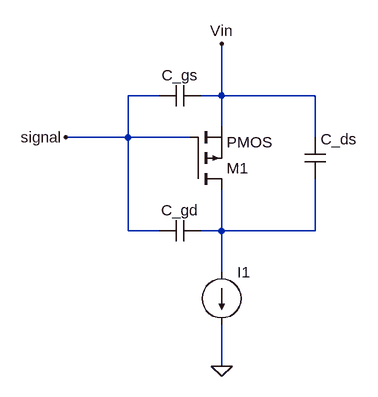
[diagram p0: schematic Draft1.asc]
Draft1.asc, the LTspice schematic file:
Version 4
SHEET 1 880 680
WIRE 176 96 128 96
WIRE 272 96 272 16
WIRE 272 96 240 96
WIRE 416 96 272 96
WIRE 272 144 272 96
WIRE 128 160 128 96
WIRE 128 160 32 160
WIRE 224 160 128 160
WIRE 416 160 416 96
WIRE 128 304 128 160
WIRE 176 304 128 304
WIRE 272 304 272 240
WIRE 272 304 240 304
WIRE 416 304 416 224
WIRE 416 304 272 304
WIRE 272 368 272 304
WIRE 272 512 272 448
FLAG 272 512 0
FLAG 272 16 Vin
FLAG 32 160 signal
SYMBOL pmos 224 240 M180
SYMATTR InstName M1
SYMBOL cap 240 80 R90
WINDOW 0 0 32 VBottom 2
WINDOW 3 32 32 VTop 2
SYMATTR InstName C_gs
SYMATTR Value ""
SYMBOL cap 240 288 R90
WINDOW 0 0 32 VBottom 2
WINDOW 3 32 32 VTop 2
SYMATTR InstName C_gd
SYMATTR Value ""
SYMBOL cap 432 224 R180
WINDOW 0 -49 61 Left 2
WINDOW 3 -15 1 Left 2
SYMATTR InstName C_ds
SYMATTR Value ""
SYMBOL current 272 368 R0
SYMATTR InstName I1
SYMATTR Value ""

The netlist it stands for:
* Draft1.asc
M1 N001 signal Vin Vin PMOS
C_gs Vin signal
C_gd N001 signal
C_ds N001 Vin
I1 N001 0
.model NMOS NMOS
.model PMOS PMOS
.lib standard.mos
.backanno
.end